# EAGLE design ETH_Design_ESP32 (EAGLE 9.6.1)
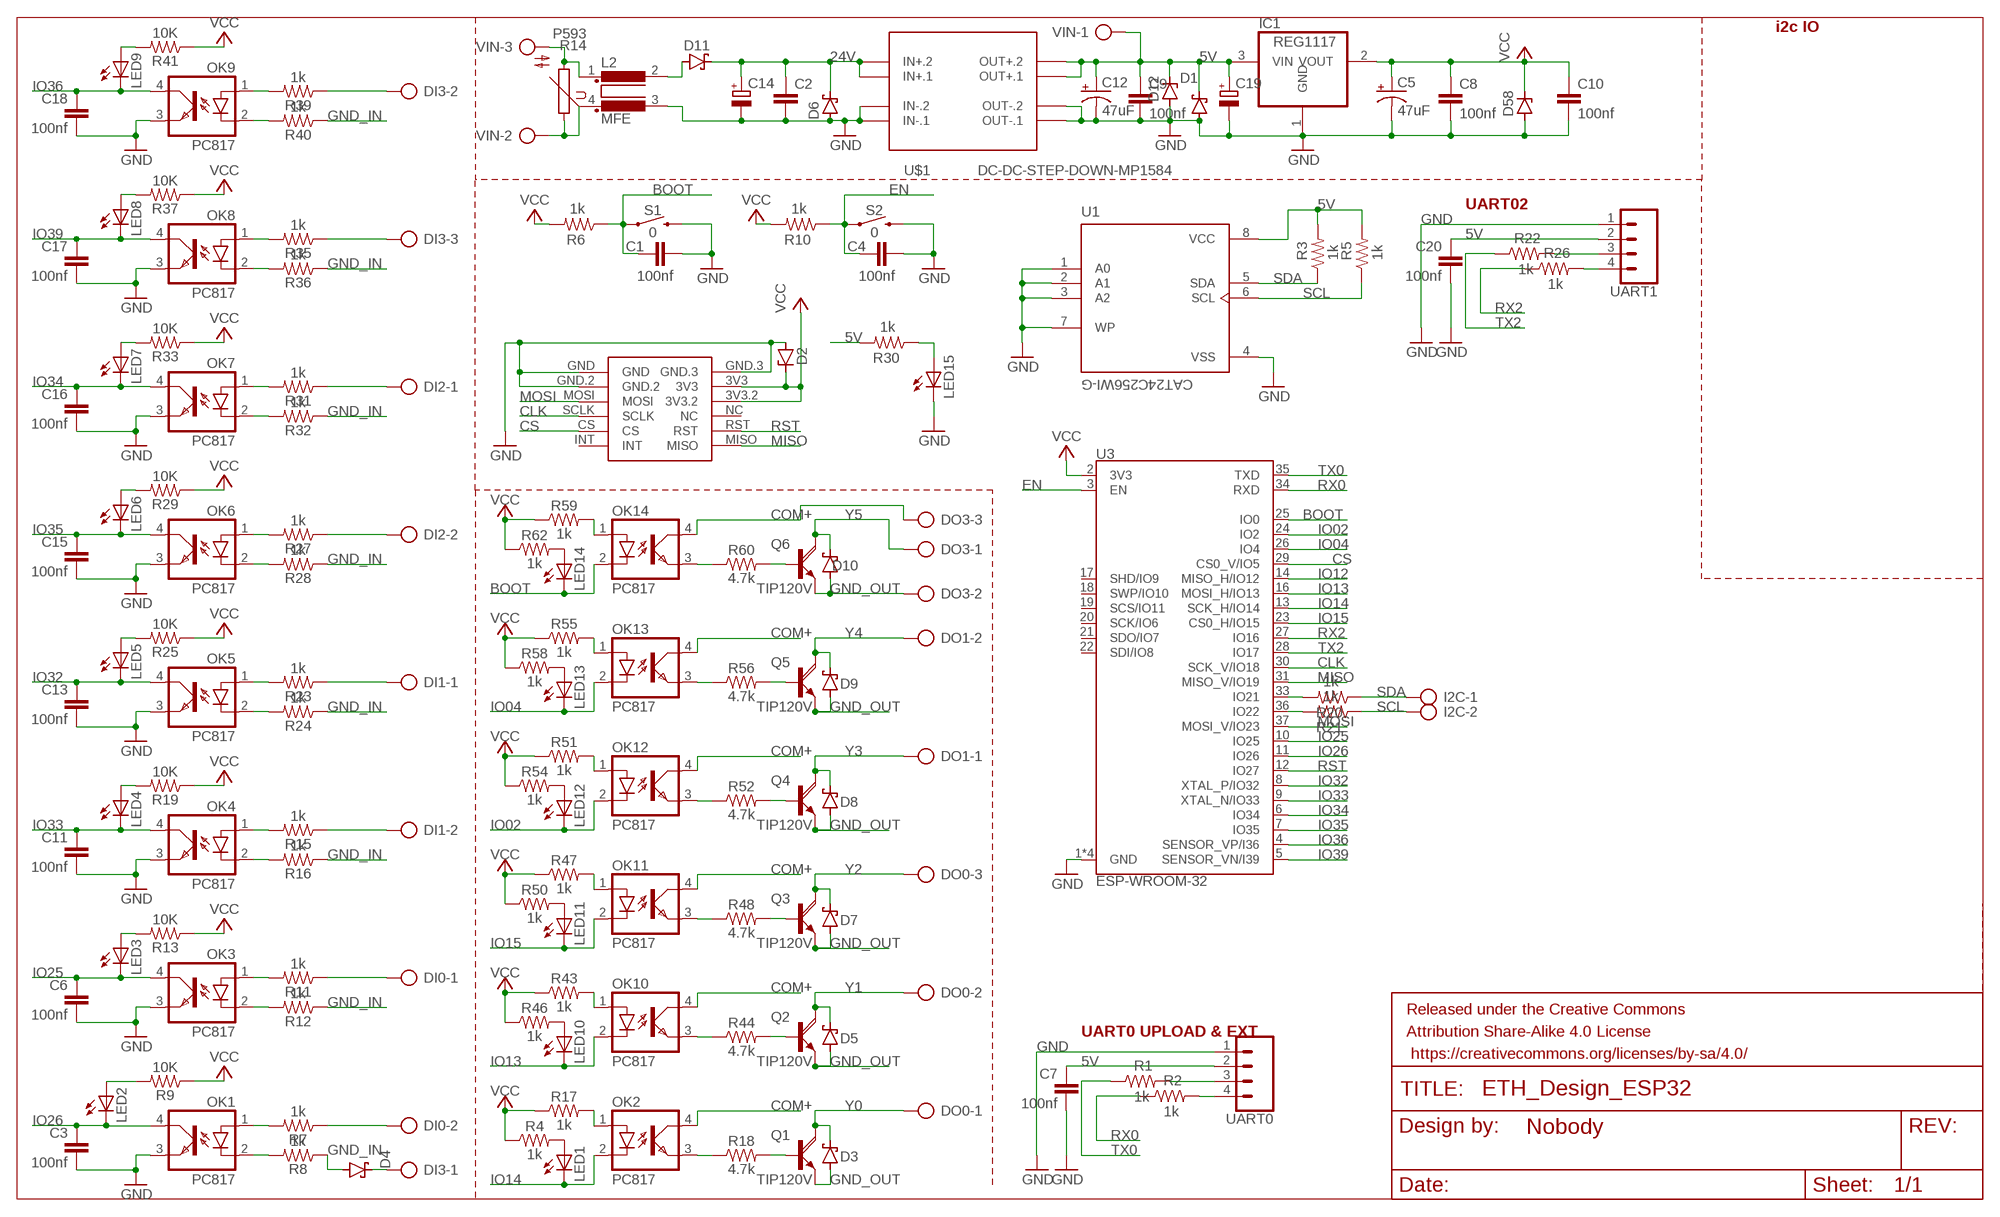
[diagram p0: schematic, sheet 1]

## Parts
C1  100nf  39NF-0805-50V-10%  [0805]
C2  C-EUC1206K  [C1206K]
C3  100nf  39NF-0805-50V-10%  [0805]
C4  100nf  39NF-0805-50V-10%  [0805]
C5  47uF  47UF-POLAR-EIA3528-10V-10%  [EIA3528]
C6  100nf  39NF-0805-50V-10%  [0805]
C7  100nf  39NF-0805-50V-10%  [0805]
C8  100nf  39NF-0805-50V-10%  [0805]
C9  100nf  39NF-0805-50V-10%  [0805]
C10  100nf  39NF-0805-50V-10%  [0805]
C11  100nf  39NF-0805-50V-10%  [0805]
C12  47uF  47UF-POLAR-EIA3528-10V-10%  [EIA3528]
C13  100nf  39NF-0805-50V-10%  [0805]
C14  CPOL-EUE2.5-7  [E2,5-7]
C15  100nf  39NF-0805-50V-10%  [0805]
C16  100nf  39NF-0805-50V-10%  [0805]
C17  100nf  39NF-0805-50V-10%  [0805]
C18  100nf  39NF-0805-50V-10%  [0805]
C19  CPOL-EUE2.5-7  [E2,5-7]
C20  100nf  39NF-0805-50V-10%  [0805]
D1  SCHOTTKY-DIODESMD  [SMB]
D2  ZENER-DIODESOD80C  [SOD80C]
D3  SCHOTTKY-DIODESMD  [SMB]
D4  SCHOTTKY-DIODESMD  [SMB]
D5  SCHOTTKY-DIODESMD  [SMB]
D6  SCHOTTKY-DIODESMD  [SMB]
D7  SCHOTTKY-DIODESMD  [SMB]
D8  SCHOTTKY-DIODESMD  [SMB]
D9  SCHOTTKY-DIODESMD  [SMB]
D10  SCHOTTKY-DIODESMD  [SMB]
D11  SCHOTTKY-DIODESMD  [SMB]
D12  ZENER-DIODESOD80C  [SOD80C]
D58  ZENER-DIODESOD80C  [SOD80C]
DI0  AK500/2  [AK500/2]
DI1  AK500/2  [AK500/2]
DI2  AK500/2  [AK500/2]
DI3  AK500/3  [AK500/3]
DO0  AK500/3  [AK500/3]
DO1  AK500/2  [AK500/2]
DO3  AK500/3  [AK500/3]
FRAME1  FRAME-LETTERNO_PACKAGE  [DUMMY]
I2C  AK500/2  [AK500/2]
IC1  REG1117  [SOT223]
L2  MFE  [MFE]
LED1  LEDCHIPLED_0805  [CHIPLED_0805]
LED2  LEDCHIPLED_0805  [CHIPLED_0805]
LED3  LEDCHIPLED_0805  [CHIPLED_0805]
LED4  LEDCHIPLED_0805  [CHIPLED_0805]
LED5  LEDCHIPLED_0805  [CHIPLED_0805]
LED6  LEDCHIPLED_0805  [CHIPLED_0805]
LED7  LEDCHIPLED_0805  [CHIPLED_0805]
LED8  LEDCHIPLED_0805  [CHIPLED_0805]
LED9  LEDCHIPLED_0805  [CHIPLED_0805]
LED10  LEDCHIPLED_0805  [CHIPLED_0805]
LED11  LEDCHIPLED_0805  [CHIPLED_0805]
LED12  LEDCHIPLED_0805  [CHIPLED_0805]
LED13  LEDCHIPLED_0805  [CHIPLED_0805]
LED14  LEDCHIPLED_0805  [CHIPLED_0805]
LED15  LEDCHIPLED_0805  [CHIPLED_0805]
OK1  PC817  [DIL04]
OK2  PC817  [DIL04]
OK3  PC817  [DIL04]
OK4  PC817  [DIL04]
OK5  PC817  [DIL04]
OK6  PC817  [DIL04]
OK7  PC817  [DIL04]
OK8  PC817  [DIL04]
OK9  PC817  [DIL04]
OK10  PC817  [DIL04]
OK11  PC817  [DIL04]
OK12  PC817  [DIL04]
OK13  PC817  [DIL04]
OK14  PC817  [DIL04]
Q1  TIP120V  [TO220AV]
Q2  TIP120V  [TO220AV]
Q3  TIP120V  [TO220AV]
Q4  TIP120V  [TO220AV]
Q5  TIP120V  [TO220AV]
Q6  TIP120V  [TO220AV]
R1  1k  0.3OHM-0805-1/8W-1%  [0805]
R2  1k  0.3OHM-0805-1/8W-1%  [0805]
R3  1k  0.3OHM-0805-1/8W-1%  [0805]
R4  1k  0.75OHM-0805-1/4W-1%  [0805]
R5  1k  0.3OHM-0805-1/8W-1%  [0805]
R6  1k  0.3OHM-0805-1/8W-1%  [0805]
R7  1k  0.75OHM-0805-1/4W-1%  [0805]
R8  1k  0.75OHM-0805-1/4W-1%  [0805]
R9  10K  0.75OHM-0805-1/4W-1%  [0805]
R10  1k  0.3OHM-0805-1/8W-1%  [0805]
R11  1k  0.75OHM-0805-1/4W-1%  [0805]
R12  1k  0.75OHM-0805-1/4W-1%  [0805]
R13  10K  0.75OHM-0805-1/4W-1%  [0805]
R14  P593  [P593]
R15  1k  0.75OHM-0805-1/4W-1%  [0805]
R16  1k  0.75OHM-0805-1/4W-1%  [0805]
R17  1k  0.75OHM-0805-1/4W-1%  [0805]
R18  4.7k  0.75OHM-0805-1/4W-1%  [0805]
R19  10K  0.75OHM-0805-1/4W-1%  [0805]
R20  1k  0.3OHM-0805-1/8W-1%  [0805]
R21  1k  0.3OHM-0805-1/8W-1%  [0805]
R22  1k  0.3OHM-0805-1/8W-1%  [0805]
R23  1k  0.75OHM-0805-1/4W-1%  [0805]
R24  1k  0.75OHM-0805-1/4W-1%  [0805]
R25  10K  0.75OHM-0805-1/4W-1%  [0805]
R26  1k  0.3OHM-0805-1/8W-1%  [0805]
R27  1k  0.75OHM-0805-1/4W-1%  [0805]
R28  1k  0.75OHM-0805-1/4W-1%  [0805]
R29  10K  0.75OHM-0805-1/4W-1%  [0805]
R30  1k  0.3OHM-0805-1/8W-1%  [0805]
R31  1k  0.75OHM-0805-1/4W-1%  [0805]
R32  1k  0.75OHM-0805-1/4W-1%  [0805]
R33  10K  0.75OHM-0805-1/4W-1%  [0805]
R35  1k  0.75OHM-0805-1/4W-1%  [0805]
R36  1k  0.75OHM-0805-1/4W-1%  [0805]
R37  10K  0.75OHM-0805-1/4W-1%  [0805]
R39  1k  0.75OHM-0805-1/4W-1%  [0805]
R40  1k  0.75OHM-0805-1/4W-1%  [0805]
R41  10K  0.75OHM-0805-1/4W-1%  [0805]
R43  1k  0.75OHM-0805-1/4W-1%  [0805]
R44  4.7k  0.75OHM-0805-1/4W-1%  [0805]
R46  1k  0.75OHM-0805-1/4W-1%  [0805]
R47  1k  0.75OHM-0805-1/4W-1%  [0805]
R48  4.7k  0.75OHM-0805-1/4W-1%  [0805]
R50  1k  0.75OHM-0805-1/4W-1%  [0805]
R51  1k  0.75OHM-0805-1/4W-1%  [0805]
R52  4.7k  0.75OHM-0805-1/4W-1%  [0805]
R54  1k  0.75OHM-0805-1/4W-1%  [0805]
R55  1k  0.75OHM-0805-1/4W-1%  [0805]
R56  4.7k  0.75OHM-0805-1/4W-1%  [0805]
R58  1k  0.75OHM-0805-1/4W-1%  [0805]
R59  1k  0.75OHM-0805-1/4W-1%  [0805]
R60  4.7k  0.75OHM-0805-1/4W-1%  [0805]
R62  1k  0.75OHM-0805-1/4W-1%  [0805]
S1  0  MOMENTARY-SWITCH-SPST-PTH-6.0MM-KIT  [TACTILE_SWITCH_PTH_6.0MM_KIT]
S2  0  MOMENTARY-SWITCH-SPST-PTH-6.0MM-KIT  [TACTILE_SWITCH_PTH_6.0MM_KIT]
U1  CAT24C256WI-G  [SOIC127P600X175-8N]
U3  ESP-WROOM-32  [ESP-WROOM-32]
U$1  DC-DC-STEP-DOWN-MP1584  [DC-DC-STEP-DOWN-MP1584]
U$2  MINI_W5500  [MINI_W5500]
UART0  CONN_04POLAR  [MOLEX-1X4]
UART1  CONN_04POLAR  [MOLEX-1X4]
VIN  AK500/3  [AK500/3]

## Nets
5V: C7.1 C9.1 C12.A(+) C19.+ C20.1 D1.C D12.C IC1.3(VIN) R3.2 R5.2 R30.2 U1.8(VCC) U$1.OUT+.1 U$1.OUT+.2 UART0.2 UART1.2 VIN.1
24V: C2.1 C14.+ D6.C D11.C U$1.IN+.1 U$1.IN+.2
BOOT: C1.2 LED14.C OK14.2(C) R6.1 S1.1 U3.25(IO0)
CLK: U3.30(SCK_V/IO18) U$2.SCLK
COM+: DO3.3 OK2.4(COL) OK10.4(COL) OK11.4(COL) OK12.4(COL) OK13.4(COL) OK14.4(COL)
CS: U3.29(CS0_V/IO5) U$2.CS
EN: C4.2 R10.1 S2.1 U3.3(EN)
GND: C1.1 C2.2 C3.2 C4.1 C5.C(-) C6.2 C7.2 C8.2 C9.2 C10.2 C11.2 C12.C(-) C13.2 C14.- C15.2 C16.2 C17.2 C18.2 C19.- C20.2 D1.A D2.A D6.A D12.A D58.A IC1.1(GND) L2.3 LED15.C OK1.3(EMIT) OK3.3(EMIT) OK4.3(EMIT) OK5.3(EMIT) OK6.3(EMIT) OK7.3(EMIT) OK8.3(EMIT) OK9.3(EMIT) S1.3 S2.3 U1.1(A0) U1.2(A1) U1.3(A2) U1.4(VSS) U1.7(WP) U3.1(GND) U3.15(GND) U3.38(GND) U3.GND U$1.IN-.1 U$1.IN-.2 U$1.OUT-.1 U$1.OUT-.2 U$2.GND U$2.GND.2 U$2.GND.3 UART0.1 UART1.1
GND_IN: D4.A R8.1 R12.1 R16.1 R24.1 R28.1 R32.1 R36.1 R40.1
GND_OUT: D3.A D5.A D7.A D8.A D9.A D10.A DO3.2 Q1.E Q2.E Q3.E Q4.E Q5.E Q6.E
IO02: LED12.C OK12.2(C) U3.24(IO2)
IO04: LED13.C OK13.2(C) U3.26(IO4)
IO12: U3.14(MISO_H/IO12)
IO13: LED10.C OK10.2(C) U3.16(MOSI_H/IO13)
IO14: LED1.C OK2.2(C) U3.13(SCK_H/IO14)
IO15: LED11.C OK11.2(C) U3.23(CS0_H/IO15)
IO25: C6.1 LED3.C OK3.4(COL) U3.10(IO25)
IO26: C3.1 LED2.C OK1.4(COL) U3.11(IO26)
IO32: C13.1 LED5.C OK5.4(COL) U3.8(XTAL_P/IO32)
IO33: C11.1 LED4.C OK4.4(COL) U3.9(XTAL_N/IO33)
IO34: C16.1 LED7.C OK7.4(COL) U3.6(IO34)
IO35: C15.1 LED6.C OK6.4(COL) U3.7(IO35)
IO36: C18.1 LED9.C OK9.4(COL) U3.4(SENSOR_VP/I36)
IO39: C17.1 LED8.C OK8.4(COL) U3.5(SENSOR_VN/I39)
MISO: U3.31(MISO_V/IO19) U$2.MISO
MOSI: U3.37(MOSI_V/IO23) U$2.MOSI
N$1: R1.2 UART0.3
N$2: R2.2 UART0.4
N$3: R22.2 UART1.3
N$4: OK1.1(A) R7.2
N$5: L2.1 R14.2 VIN.3
N$6: L2.4 R14.1 VIN.2
N$7: OK2.1(A) R17.2
N$8: LED1.A R4.2
N$9: LED8.A R37.2
N$10: OK1.2(C) R8.2
N$11: LED7.A R33.2
N$12: LED6.A R29.2
N$13: LED5.A R25.2
N$14: R26.2 UART1.4
N$15: LED15.A R30.1
N$16: OK3.1(A) R11.2
N$17: OK2.3(EMIT) R18.1
N$19: D11.A L2.2
N$20: OK3.2(C) R12.2
N$23: LED2.A R9.2
N$24: LED3.A R13.2
N$25: OK4.1(A) R15.2
N$26: OK4.2(C) R16.2
N$27: LED4.A R19.2
N$28: R20.2 U3.33(IO21)
N$29: R21.2 U3.36(IO22)
N$31: OK5.1(A) R23.2
N$32: OK5.2(C) R24.2
N$44: OK6.1(A) R27.2
N$45: OK6.2(C) R28.2
N$48: OK7.1(A) R31.2
N$49: OK7.2(C) R32.2
N$52: OK8.1(A) R35.2
N$53: OK8.2(C) R36.2
N$62: OK9.1(A) R39.2
N$63: OK9.2(C) R40.2
N$66: DI0.2 R7.1
N$67: Q1.B R18.2
N$68: OK10.3(EMIT) R44.1
N$70: OK10.1(A) R43.2
N$71: LED10.A R46.2
N$73: Q2.B R44.2
N$74: OK11.3(EMIT) R48.1
N$76: OK11.1(A) R47.2
N$77: LED11.A R50.2
N$79: Q3.B R48.2
N$80: OK12.3(EMIT) R52.1
N$82: OK12.1(A) R51.2
N$83: LED12.A R54.2
N$84: LED9.A R41.2
N$85: Q4.B R52.2
N$86: OK13.3(EMIT) R56.1
N$87: DI0.1 R11.1
N$88: OK13.1(A) R55.2
N$89: LED13.A R58.2
N$90: DI1.2 R15.1
N$91: Q5.B R56.2
N$92: OK14.3(EMIT) R60.1
N$93: DI1.1 R23.1
N$94: OK14.1(A) R59.2
N$95: LED14.A R62.2
N$96: DI2.2 R27.1
N$97: Q6.B R60.2
N$98: DI2.1 R31.1
N$99: DI3.3 R35.1
N$100: DI3.2 R39.1
N$101: D4.C DI3.1
RST: U3.12(IO27) U$2.RST
RX0: R2.1 U3.34(RXD)
RX2: R26.1 U3.27(IO16)
SCL: I2C.2 R5.1 R21.1 U1.6(SCL)
SDA: I2C.1 R3.1 R20.1 U1.5(SDA)
TX0: R1.1 U3.35(TXD)
TX2: R22.1 U3.28(IO17)
VCC: C5.A(+) C8.1 C10.1 D2.C D58.C IC1.2(VOUT) R4.1 R6.2 R9.1 R10.2 R13.1 R17.1 R19.1 R25.1 R29.1 R33.1 R37.1 R41.1 R43.1 R46.1 R47.1 R50.1 R51.1 R54.1 R55.1 R58.1 R59.1 R62.1 U3.2(3V3) U$2.3V3 U$2.3V3.2
Y0: D3.C DO0.1 Q1.C
Y1: D5.C DO0.2 Q2.C
Y2: D7.C DO0.3 Q3.C
Y3: D8.C DO1.1 Q4.C
Y4: D9.C DO1.2 Q5.C
Y5: D10.C DO3.1 Q6.C
Unconnected: U3.17(SHD/IO9) U3.18(SWP/IO10) U3.19(SCS/IO11) U3.20(SCK/IO6) U3.21(SDO/IO7) U3.22(SDI/IO8) U$2.INT U$2.NC

## Notes on the sheet
- i2c IO
- UART02
- UART0 UPLOAD & EXT

## Library data of the parts
C1 C3 C4 C6-C11 C13 C15-C18 C20 = SparkFun-Capacitors:39NF: 39nF ceramic capacitors A capacitor is a passive two-terminal electrical component used to store electrical energy temporarily in an electric field.; PROD_ID: CAP-15816; VALUE: 39nF
C2 = rcl:C-EU: CAPACITOR, European symbol; SPICEPREFIX: C
C5 C12 = SparkFun-Capacitors:47UF-POLAR: 47µF polarized capacitors A capacitor is a passive two-terminal electrical component used to store electrical energy temporarily in an electric field.; PROD_ID: CAP-08310
C14 C19 = rcl:CPOL-EU: POLARIZED CAPACITOR, European symbol; SPICEPREFIX: C
D1 D3-D11 = diode:SCHOTTKY-DIODE: Schottky Diode
D2 D12 D58 = diode:ZENER-DIODE: Z-Diode
DI0 DI1 DI2 DO1 I2C = con-ptr500:AK500/2: CONNECTOR; OC_FARNELL: unknown; OC_NEWARK: unknown
DI3 DO0 DO3 VIN = con-ptr500:AK500/3: CONNECTOR; OC_FARNELL: unknown; OC_NEWARK: unknown
FRAME1 = SparkFun-Aesthetics:FRAME-LETTER: Schematic Frame - Letter Standard 8.5x11 US Letter frame; DESIGNER: Nobody; VERSION: v01
IC1 = burr-brown:REG1117: 800mA and 1A Low Dropout (LDO) Positive Regulator 1.8V, 2.5V, 2.85V, 3.3V, 5V, and Adj; MPN: REG1117; OC_FARNELL: 1097566; OC_NEWARK: 14P6981
L2 = inductors:MFE: FILTER
LED1-LED15 = adafruit:LED: LED OSRAM: - CHIPLED LG R971, LG N971, LY N971, LG Q971, LY Q971, LO R971, LY R971 LH N974, LH R974 LS Q976, LO Q976, LY Q976 LO Q996 - Hyper CHIPLED LW Q18S LB Q993, LB Q99A, LB R99A - SideLED LS A670, LO A670, LY A670, LG A670, LP A670 LB A673, LV A673, LT A673, LW A673 LH A674 LY A675 LS A676, LA A676, LO A676, LY A676, LW A676 LS A679, LY A679, LG A679 - Hyper Micro SIDELED® LS Y876, LA Y876, LO Y876, LY Y876 LT Y87S - SmartLED LW L88C, LW L88S LB L89C, LB L89S, LG L890 LS L89K, LO L89K, LY L89K LS L896, LA L896, LO L896, LY L896 - TOPLED LS T670, LO T670, LY T670, LG T670, LP T670 LSG T670, LSP T670, LSY T670, LOP T670, LYG T670 LG T671, LOG T671, LSG T671 LB T673, LV T673, LT T673, LW T673 LH T674 LS T676, LA T676, LO T676, LY T676, LB T676, LH T676, LSB T676, LW T676 LB T67C, LV T67C, LT T67C, LS T67K, LO T67K, LY T67K, LW E67C LS E67B, LA E67B, LO E67B, LY E67B, LB E67C, LV E67C, LT E67C LW T67C LS T679, LY T679, LG T679 LS T770, LO T770, LY T770, LG T770, LP T770 LB T773, LV T773, LT T773, LW T773 LH T774 LS E675, LA E675, LY E675, LS T675 LS T776, LA T776, LO T776, LY T776, LB T776 LHGB T686 LT T68C, LB T68C - Hyper Mini TOPLED® LB M676 - Mini TOPLED Santana® LG M470 LS M47K, LO M47K, LY M47K Source: http://www.osram.convergy.de/
OK1-OK14 = optocoupler:PC817: SHARP OPTO COUPLER; MPN: PC817X4J000F; OC_FARNELL: 9707727; OC_NEWARK: 97K7059
Q1-Q6 = rocketfarm:TIP120: NPN DARLINGTON TRANSISTOR
R1-R3 R5 R6 R10 R20-R22 R26 R30 = SparkFun-Resistors:0.3OHM: 0.3Ω resistor A resistor is a passive two-terminal electrical component that implements electrical resistance as a circuit element. Resistors act to reduce current flow, and, at the same time, act to lower voltage levels within circuits. - Wikipedia; PROD_ID: RES-11622; VALUE: 0.3
R4 R7-R9 R11-R13 R15-R19 R23-R25 R27-R29 R31-R33 R35-R37 R39-R41 R43 R44 R46-R48 R50-R52 R54-R56 R58-R60 R62 = SparkFun-Resistors:0.75OHM: 0.75Ω resistor A resistor is a passive two-terminal electrical component that implements electrical resistance as a circuit element. Resistors act to reduce current flow, and, at the same time, act to lower voltage levels within circuits. - Wikipedia; PROD_ID: RES-08474; VALUE: 0.75
R14 = varistor:P593: VARISTOR
S1 S2 = SparkFun-Switches:MOMENTARY-SWITCH-SPST: Momentary Switch (Pushbutton) - SPST Normally-open (NO) SPST momentary switches (buttons, pushbuttons). Variants PTH-12MM - 12mm square, through-hole Momentary Pushbutton Switch - 12mm Square (COM-09190) PTH-6.0MM, PTH-6.0MM-KIT - 6.0mm square, through-hole Mini Pushbutton Switch (COM-00097) KIT package intended for soldering kit's - only one side of pads' copper is exposed. PTH-RIGHT-ANGLE-KIT - Right-angle, through-hole Right Angle Tactile Button - Used on SparkFun BigTime Watch Kit SMD-12MM - 12mm square, surface-mount Tactile Button - SMD (12mm) (COM-12993) Used on SparkFun PicoBoard SMD-4.5MM - 4.5mm Square Trackball Switch Used on SparkFun Blackberry Trackballer Breakout SMD-4.6MMX2.8MM - 4.60mm x 2.80mm, surface mount Used on SparkFun SAMD21 Mini Breakout SMD-5.2MM, SMD-5.2-REDUNDANT - 5.2mm square, surface-mount Mini Pushbutton Switch - SMD (COM-08720) Used on Arduino Pro Mini REDUNDANT package connects both switch circuits together SMD-6.0X3.5MM - 6.0 x 3.5mm, surface mount Momentary Reset Switch SMD (COM-08229) SMD-6.2MM-TALL - 6.2mm square, surface mount Tactile Button - SMD (6mm) Used on SparkFun Digital Sandbox SMD-RIGHT-ANGLE - Right-angle, surface mount Used on SparkFun Block for Intel® Edison - Arduino; PROD_ID: SWCH-08441; SF_SKU: COM-00097
U1 = CAT24C256WI-G:CAT24C256WI-G: EEPROM Memory IC 256Kb (32K x 8) I²C 1MHz 500ns 8-SOIC Check availability; AVAILABILITY: In Stock; DESCRIPTION: EEPROM, 256K, 256KX8, I2C, SOIC8; Memory Size:256Kbit; Memory Configuration:32K x 8; Interface Type:I2C; Clock Frequency:100kHz; Supply Voltage Range:1.8V to 5.5V; Memory Case Style:SOIC; No. of Pins:8; Operating Temperature Range:-40°C to +85°C; SVHC:No SVHC (18-Jun-2012); Frequency:400kHz; IC Generic Number:24C256; Interface:I2C; Interface Type:Serial, I2C; Memory Type:Serial EEPROM; Memory Voltage Vcc:1.8 to 5.5V; Operating Temperature Max:+85°C; Operating Temperature Min:-40°C; Package / Case:SOIC; Supply Voltage Max:5.5V; Supply Voltage Min:1.8V; Termination Type:SMD; MF: ON Semiconductor; MP: CAT24C256WI-G; PACKAGE: SOIC-8 ON; PRICE: None; PURCHASE-URL: https://pricing.snapeda.com/search/part/CAT24C256WI-G/?ref=eda
U3 = SparkFun-RF:ESP-WROOM-32; PROD_ID: IC-13849
U$1 = diy-modules:DC-DC-STEP-DOWN-MP1584: DC/DC Step-Down Regulator based on MP1584 chip MP1584 datasheet available here: http://www.haoyuelectronics.com/Attachment/MP1584/MP1584.pdf Click here to find device on ebay.com
U$2 = ethernet-w5500:MINI_W5500: MINI ETHERNET W5500, CREATE BY MIKROAVR.COM
UART0 UART1 = SparkFun-Connectors:CONN_04: Multi connection point. Often used as Generic Header-pin footprint for 0.1 inch spaced/style header connections On any of the 0.1 inch spaced packages, you can populate with these: Break Away Headers - Straight (PRT-00116) Break Away Male Headers - Right Angle (PRT-00553) Female Headers (PRT-00115) Break Away Headers - Machine Pin (PRT-00117) Break Away Female Headers - Swiss Machine Pin (PRT-00743) For SCREWTERMINALS and SPRING TERMINALS visit here: Screw Terimnals on SparkFun.com (5mm/3.5mm/2.54mm spacing) This device is also useful as a general connection point to wire up your design to another part of your project. Our various solder wires solder well into these plated through hole pads. Hook-Up Wire - Assortment (Stranded, 22 AWG) (PRT-11375) Hook-Up Wire - Assortment (Solid Core, 22 AWG) (PRT-11367) View the entire wire category on our website here Special notes: Molex polarized connector foot print use with SKU : PRT-08231 with associated crimp pins and housings. 1MM SMD Version SKU: PRT-10208; PROD_ID: CONN-08186; SF_ID: PRT-08231

## Board
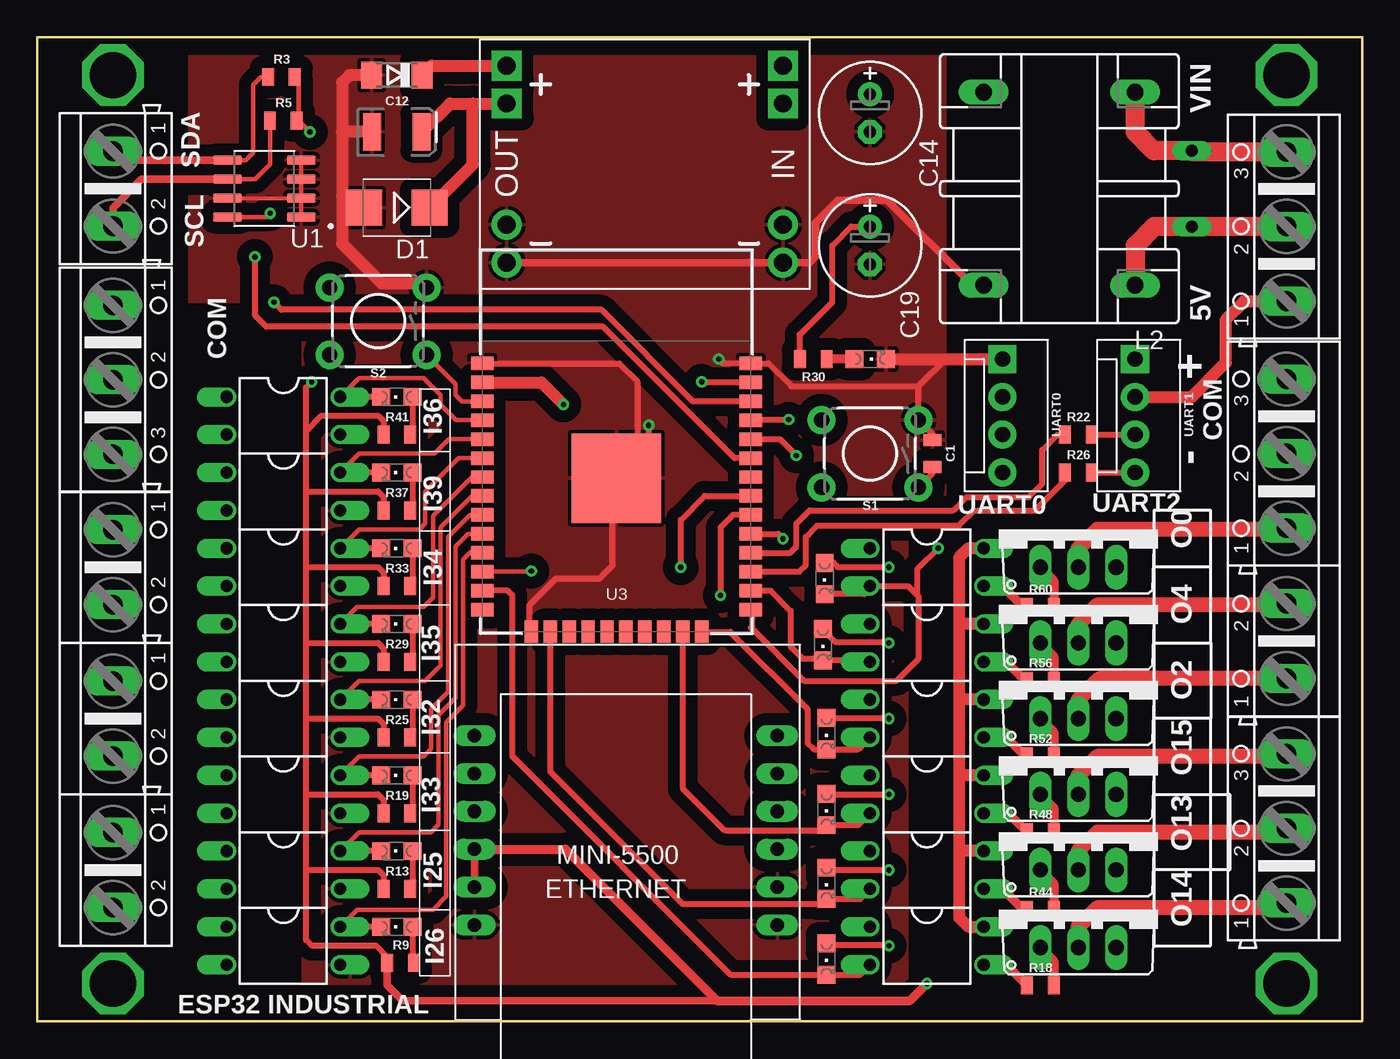
[diagram p1: board, top side]
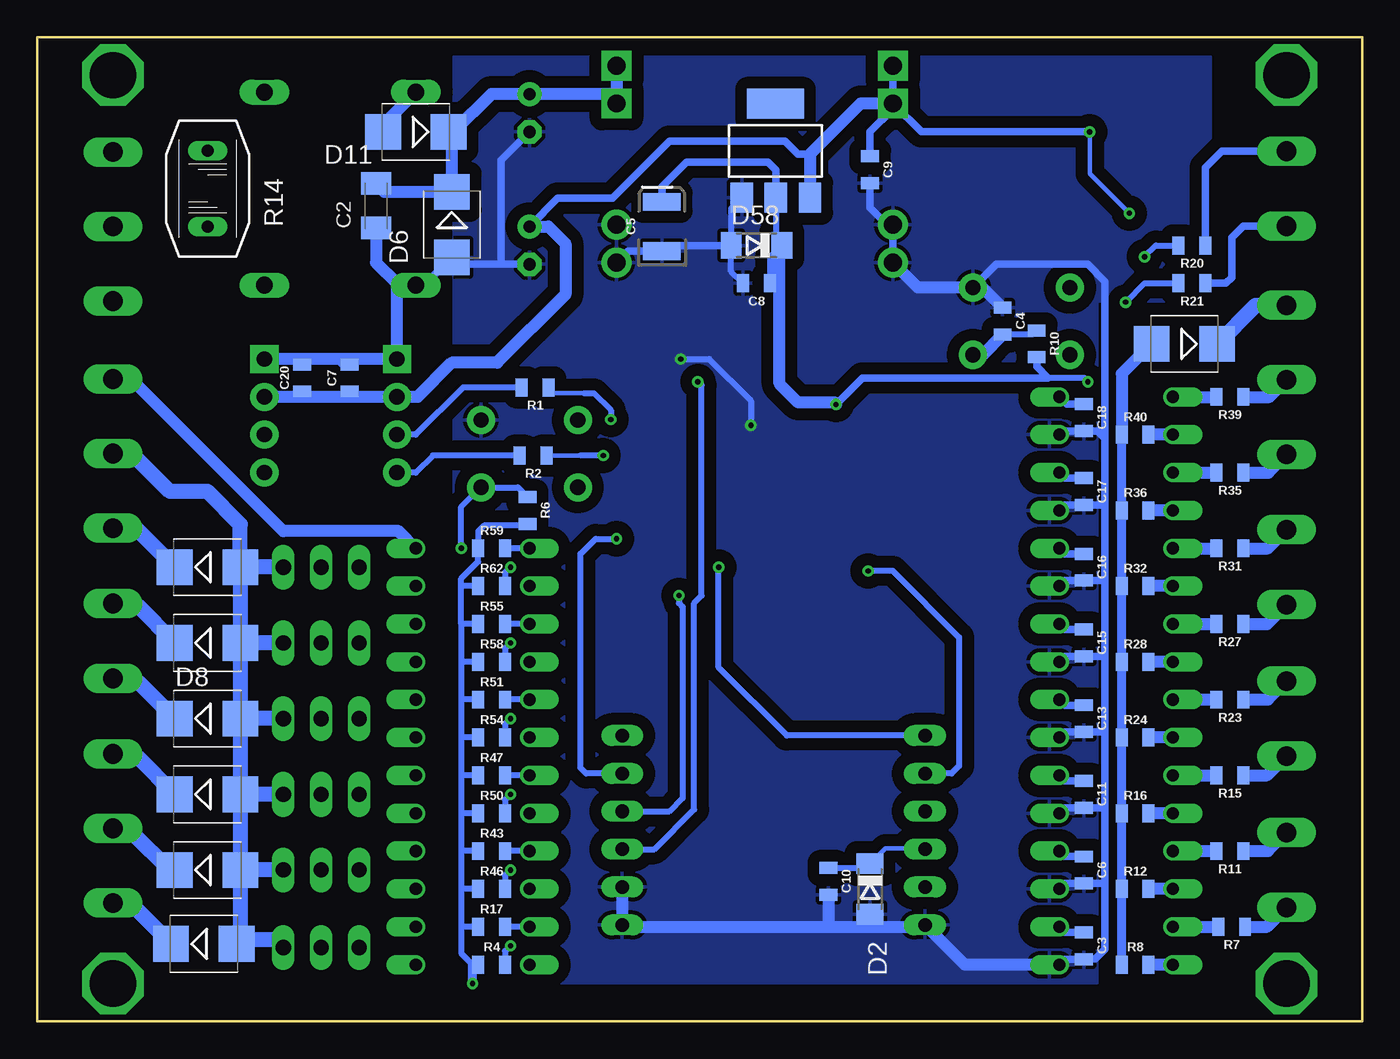
[diagram p2: board, bottom side, seen from below]

Size 88.9 x 66.04 mm. Coordinates in mm from the lower left corner, seen from the top.
Outline: 0,0 88.9,0 88.9,66.04 0,66.04 0,0
Copper layers (1*16): Top 0.035mm / dielectric 1.5mm / Bottom 0.035mm
Design rules "default": minimum track width 6mil, minimum drill 0.35mm, track to track 6mil, track to pad 6mil, pad to pad 6mil, via to via 6mil, smd to smd 6mil, copper to edge 40mil, drill to drill 6mil, minimum pad ring 10mil, minimum via ring 8mil, stop-mask expansion 4mil, vias tented up to drill 0mil, thermal gap 10mil

### Footprints (pad centres in the part's own frame; a part is rotated, then mirrored left to right if it is on the bottom)
0805 = smd 0.8 x 1.2: 1 -0.9,0; 2 0.9,0
C1206K = smd 1.5 x 2: 1 -1.5,0; 2 1.5,0
EIA3528 = smd 1.2 x 2.5: A 1.65,0; C -1.65,0
E2,5-7 = drill 0.813 pad 1.6: + -1.27,0 | drill 0.813 pad 1.6 octagon: - 1.27,0
SMB = smd 2.4 x 2.4: A 2.2,0; C -2.2,0
SOD80C = smd 1.4 x 1.8: A 1.7,0; C -1.7,0
AK500/2 = drill 1.321 long: 1 -2.515,0; 2 2.515,0
AK500/3 = drill 1.321 long: 1 -5.004,0; 2 0,0; 3 5.004,0
SOT223 = smd 1.499 x 2.007: 1 -2.261,-3.15; 2 0.025,-3.15; 3 2.311,-3.15 | smd 3.81 x 2.007: 4 0,3.15
MFE = drill 1.118 long: 1 6.477,-5.08; 2 6.477,5.08; 3 -6.477,5.08; 4 -6.477,-5.08
CHIPLED_0805 = smd 1.2 x 1.2: A 0,-1.05; C 0,1.05
DIL04 = drill 0.813 offset: 1 -1.27,-3.81; 2 1.27,-3.81; 3 1.27,3.81; 4 -1.27,3.81
TO220AV = drill 1.016 long: B -2.54,-2.54; C 0,-2.54; E 2.54,-2.54
P593 = drill 0.813 long: 1 0,2.54; 2 0,-2.54
TACTILE_SWITCH_PTH_6.0MM_KIT = drill 1.016 pad 1.88: 1 -3.251,2.261; 2 3.251,2.261; 3 -3.251,-2.261; 4 3.251,-2.261
SOIC127P600X175-8N = smd 1.97 x 0.6: 1 -2.475,1.905; 2 -2.475,0.635; 3 -2.475,-0.635; 4 -2.475,-1.905; 5 2.475,-1.905; 6 2.475,-0.635; 7 2.475,0.635; 8 2.475,1.905
ESP-WROOM-32 = smd 0.9 x 1.5: 1 7.7,9; 2 6.43,9; 3 5.16,9; 4 3.89,9; 5 2.62,9; 6 1.35,9; 7 0.08,9; 8 -1.19,9; 9 -2.46,9; 10 -3.73,9; 11 -5,9; 12 -6.27,9; 13 -7.54,9; 14 -8.81,9; 25 -8.81,-9; 26 -7.54,-9; 27 -6.27,-9; 28 -5,-9; 29 -3.73,-9; 30 -2.46,-9; 31 -1.19,-9; 32 0.08,-9; 33 1.35,-9; 34 2.62,-9; 35 3.89,-9; 36 5.16,-9; 37 6.43,-9; 38 7.7,-9 | smd 1.5 x 0.9: 15 -10.3,5.715; 16 -10.3,4.445; 17 -10.3,3.175; 18 -10.3,1.905; 19 -10.3,0.635; 20 -10.3,-0.635; 21 -10.3,-1.905; 22 -10.3,-3.175; 23 -10.3,-4.445; 24 -10.3,-5.715 | smd 6 x 6: GND 0,0
DC-DC-STEP-DOWN-MP1584 = drill 1.2 pad 2 square: IN+.1 -9.271,-4.064; IN+.2 -9.271,-6.604; OUT+.1 9.271,-4.064; OUT+.2 9.271,-6.604 | drill 1.2 pad 2: IN-.1 -9.271,6.604; IN-.2 -9.271,4.064; OUT-.1 9.271,6.604; OUT-.2 9.271,4.064
MINI_W5500 = drill 0.914 long: 3V3 21.844,-8.89; 3V3.2 21.844,-11.43; CS 1.524,-16.51; GND 1.524,-6.35; GND.2 1.524,-8.89; GND.3 21.844,-6.35; INT 1.524,-19.05; MISO 21.844,-19.05; MOSI 1.524,-11.43; NC 21.844,-13.97; RST 21.844,-16.51; SCLK 1.524,-13.97
MOLEX-1X4 = drill 1.016 pad 1.88 square: 1 0,0 | drill 1.016 pad 1.88: 2 2.54,0; 3 5.08,0; 4 7.62,0

### Placement (x,y rotation side)
C1  60.07,38.1 270 top
C2  66.17,54.74 270 bottom
C3  18.67,5.08 270 bottom
C4  24.13,46.99 270 bottom
C5  46.99,53.34 90 bottom
C6  18.67,10.16 270 bottom
C7  67.95,43.18 90 bottom
C8  40.64,49.53 180 bottom
C9  33.02,57.15 270 bottom
C10  35.81,9.4 270 bottom
C11  18.67,15.24 270 bottom
C12  24.13,59.69 0 top
C13  18.67,20.32 270 bottom
C14  55.88,60.96 270 top
C15  18.67,25.4 270 bottom
C16  18.67,30.48 270 bottom
C17  18.67,35.56 270 bottom
C18  18.67,40.51 270 bottom
C19  55.88,52.07 270 top
C20  71.12,43.18 90 bottom
D1  24.13,54.61 180 top
D2  33.02,8.89 270 bottom
D3  77.72,5.21 0 bottom
D4  11.94,45.47 180 bottom
D5  77.47,10.16 0 bottom
D6  61.09,53.47 270 bottom
D7  77.47,15.24 0 bottom
D8  77.47,20.32 0 bottom
D9  77.47,25.4 0 bottom
D10  77.47,30.48 0 bottom
D11  63.5,59.69 180 bottom
D12  24.13,63.5 180 top
D58  40.64,52.07 180 bottom
DI0  5.08,10.16 270 top
DI1  5.08,20.32 270 top
DI2  5.08,30.48 270 top
DI3  5.08,43.05 270 top
DO0  83.82,12.95 90 top
DO1  83.82,25.53 90 top
DO3  83.82,38.1 90 top
FRAME1  0,0 0 top
I2C  5.08,55.88 270 top
IC1  39.37,58.42 0 bottom
L2  68.58,55.88 90 top
LED1  52.96,4.19 180 top
LED2  24.13,6.35 90 top
LED3  24.13,11.43 90 top
LED4  24.13,16.51 90 top
LED5  24.13,21.59 90 top
LED6  24.13,26.67 90 top
LED7  24.13,31.75 90 top
LED8  24.13,36.83 90 top
LED9  24.13,41.91 90 top
LED10  52.96,9.27 180 top
LED11  52.96,14.22 180 top
LED12  52.96,19.3 180 top
LED13  52.7,25.27 180 top
LED14  52.83,29.72 180 top
LED15  55.88,44.45 270 top
OK1  16.51,5.08 270 top
OK2  59.69,5.08 270 top
OK3  16.51,10.16 270 top
OK4  16.51,15.24 270 top
OK5  16.51,20.32 270 top
OK6  16.51,25.4 270 top
OK7  16.51,30.48 270 top
OK8  16.51,35.56 270 top
OK9  16.51,40.64 270 top
OK10  59.69,10.16 270 top
OK11  59.69,15.24 270 top
OK12  59.69,20.32 270 top
OK13  59.69,25.4 270 top
OK14  59.69,30.48 270 top
Q1  69.85,7.49 0 top
Q2  69.85,12.7 0 top
Q3  69.85,17.78 0 top
Q4  69.85,22.86 0 top
Q5  69.85,27.94 0 top
Q6  69.85,33.02 0 top
R1  55.5,42.55 180 bottom
R2  55.63,37.97 180 bottom
R3  16.38,63.37 0 top
R4  58.42,3.81 0 bottom
R5  16.51,60.45 0 top
R6  56.01,34.29 270 bottom
R7  8.76,6.35 180 bottom
R8  15.24,3.81 0 bottom
R9  24.38,3.94 0 top
R10  21.84,45.47 270 bottom
R11  8.89,11.43 180 bottom
R12  15.24,8.89 0 bottom
R13  24.13,8.89 0 top
R14  77.47,55.88 180 bottom
R15  8.89,16.51 180 bottom
R16  15.24,13.97 0 bottom
R17  58.42,6.35 0 bottom
R18  67.31,2.41 0 top
R19  24.13,13.97 0 top
R20  11.43,52.07 180 bottom
R21  11.43,49.53 180 bottom
R22  69.85,39.37 0 top
R23  8.89,21.59 180 bottom
R24  15.24,19.05 0 bottom
R25  24.13,19.05 0 top
R26  69.85,36.83 0 top
R27  8.89,26.67 180 bottom
R28  15.24,24.13 0 bottom
R29  24.13,24.13 0 top
R30  52.07,44.45 180 top
R31  8.89,31.75 180 bottom
R32  15.24,29.21 0 bottom
R33  24.13,29.21 0 top
R35  8.89,36.83 180 bottom
R36  15.24,34.29 0 bottom
R37  24.13,34.29 0 top
R39  8.89,41.91 180 bottom
R40  15.24,39.37 0 bottom
R41  24.13,39.37 0 top
R43  58.42,11.43 0 bottom
R44  67.31,7.49 0 top
R46  58.42,8.89 0 bottom
R47  58.42,16.51 0 bottom
R48  67.31,12.7 0 top
R50  58.42,13.97 0 bottom
R51  58.42,21.59 0 bottom
R52  67.31,17.78 0 top
R54  58.42,19.05 0 bottom
R55  58.42,26.67 0 bottom
R56  67.31,22.86 0 top
R58  58.42,24.13 0 bottom
R59  58.42,31.75 0 bottom
R60  67.31,27.81 0 top
R62  58.42,29.21 0 bottom
S1  55.88,38.1 180 top
S2  22.86,46.99 180 top
U1  15.24,55.88 180 top
U3  38.86,36.45 90 top
U$1  40.77,57.53 180 top
U$2  51.18,0.13 180 top
UART0  64.77,44.45 270 top
UART1  73.66,44.45 270 top
VIN  83.82,53.34 90 top

### Tracks (layer width: path | path; a pad name or v marks a point on that pad's centre or on a via)
5V  (via drill 0.35)
  Top 0.305: U1.8 15.37,53.97 v15.62,54.23 | v18.29,59.69 17.53,60.45 | 17.53,60.45 R5.2 | R3.2 17.53,63.13 17.53,60.45
  Top 0.406: R30.2 51.17,46.09 53.34,48.26 53.34,52.07 54.61,53.34 C19.+
  Top 0.813: D12.C 26.47,64.13 U$1.OUT+.2 | C12.A 27.69,61.59 29.21,61.59 | 29.21,61.59 U$1.OUT+.1 | D1.C 29.21,57.49 29.21,61.59 | UART1.2 77.47,41.91 79.76,44.2 79.76,47.12 80.98,48.34 VIN.1
  Bottom 0.305: v15.62,54.23 18.29,56.9 v18.29,59.69
  Bottom 0.508: v18.29,59.69 29.59,59.69 U$1.OUT+.1 | C9.1 33.02,59.69 31.5,61.21 U$1.OUT+.1 | U$1.OUT+.2 U$1.OUT+.1 | 37.06,58.19 37.87,58.19 38.73,59.06 46.48,59.06 50.29,55.25 53.98,55.25 C19.+
  Bottom 0.813: U$1.OUT+.1 33.66,61.59 37.06,58.19 IC1.3 | C19.+ 54.61,53.34 53.47,52.2 53.47,48.77 58.04,44.2 61.08,44.2 63.37,41.91 UART0.2 67.58,41.91 | 67.58,41.91 71.12,41.91 | 71.12,41.91 UART1.2 | C20.1 71.12,41.91 | C7.1 67.58,41.91
24V
  Bottom 0.813: U$1.IN+.2 50.04,62.23 | 50.04,62.23 U$1.IN+.1 | 50.04,62.23 C14.+ 58.42,62.23 60.96,59.69 D11.C 61.09,59.48 D6.C 65.6,55.67 C2.1
BOOT  (via drill 0.35)
  Top 0.406: LED14.C 55.5,28.67 55.88,29.05 OK14.2 58.42,29.21 59.06,28.58 | C1.2 60.07,36.78 S1.1 | 47.86,26.43 47.94,26.35 | 47.94,26.35 51.44,22.86 57.66,22.86 59.13,24.33 59.13,28.5 59.06,28.58 | 59.06,28.58 59.06,30.35 v60.45,31.75 | U3.25 47.94,27.56 47.94,26.35
  Bottom 0.406: R6.1 56.66,35.84 S1.1 60.45,34.52 v60.45,31.75
CLK  (via drill 0.35)
  Top 0.406: v45.85,28.58 45.85,33.15 46.69,33.99 U3.30
  Bottom 0.406: U$2.SCLK 46.48,14.1 45.59,14.99 45.59,27.81 45.85,28.07 v45.85,28.58
COM+
  Top 0.813: OK14.4 62.48,31.75 61.85,31.12 61.85,26.67 | 61.85,26.67 61.85,21.59 | 61.85,21.59 61.85,16.51 | 61.85,16.51 61.85,11.43 | 61.85,11.43 61.85,6.99 62.48,6.35 OK2.4 | OK13.4 61.85,26.67 | OK12.4 61.85,21.59 | OK11.4 61.85,16.51 | OK10.4 61.85,11.43
  Bottom 0.813: OK14.4 64.64,32.89 72.39,32.89 82.6,43.1 DO3.3
CS  (via drill 0.35)
  Top 0.406: U3.29 49.7,32.72 v50.04,32.38
  Bottom 0.406: U$2.CS 52.07,16.64 52.45,17.02 52.45,31.37 51.44,32.38 v50.04,32.38
EN
  Top 0.305: S2.1 28.07,42.77 28.07,42.04 28.5,41.61 U3.3
  Bottom 0.406: R10.1 22.12,46.09 C4.2
  Bottom 0.813: C4.2 25.49,44.73 S2.1
GND  (via drill 0.35)
  Top 0.254: U1.7 U1.2
  Top 0.305: U1.4 U1.3 U1.2 U1.1
  Top 0.406: C1.1 60.07,39.42 S1.3 59.13,42.62 | 59.13,42.62 60.96,44.45 UART0.1 | 59.13,42.62 50.6,42.62 49.07,44.15 U3.38 46.02,44.15 v45.72,44.45 | U3.15 33.02,26.28 33.02,27.94 34.8,29.72 37.72,29.72 38.61,30.61 38.61,36.19 | 38.61,36.19 38.61,36.96 38.86,36.7 U3.GND 40.26,37.85 40.26,42.93 39.04,44.15 U3.1 | v41.02,40 41.02,38.61 38.61,36.19
  Top 0.508: U$1.OUT-.1 U$1.IN-.1 51.82,50.93 52.2,51.31 52.2,53.59 53.72,55.12 57.02,55.12 62.74,49.4 L2.3
  Top 0.813: LED15.C UART0.1 | D12.A 20.96,63.5 20.45,62.99 20.45,59.69 | 20.45,55.37 21.72,54.1 21.93,54.31 D1.A | 20.45,59.69 20.45,55.37 | C12.C 20.45,59.69 | 20.45,55.37 20.45,52.2 23.11,49.53 25.83,49.53 S2.3
  Bottom 0.305: D2.A 33.02,6.68 32.64,6.3 29.51,6.3 U$2.GND.3 29.21,6.35
  Bottom 0.406: IC1.1 42.34,54.56 D58.A 42.34,50.33 C8.2 | v45.72,44.45 43.82,44.45 41.02,41.66 v41.02,40
  Bottom 0.508: OK9.3 20.08,39.61 C18.2 18.66,39.62 17.78,39.62 17.27,39.12 | OK8.3 19.95,34.66 C17.2 17.28,34.66 17.27,34.67 | OK7.3 19.95,29.58 C16.2 17.28,29.58 17.27,29.59 | OK6.3 19.95,24.5 C15.2 17.39,24.5 17.27,24.38 | OK5.3 19.95,19.42 C13.2 17.28,19.42 17.27,19.43 | OK4.3 19.95,14.34 C11.2 17.41,14.34 17.27,14.48 | OK3.3 19.95,9.26 C6.2 17.28,9.26 17.27,9.27 | OK1.3 19.95,4.18 C3.2 18.66,4.19 17.91,4.19 17.27,4.83 17.27,9.27 | 17.27,9.27 17.27,14.48 | 17.27,14.48 17.27,19.43 | 17.27,19.43 17.27,24.38 | 17.27,24.38 17.27,29.59 | 17.27,29.59 17.27,34.67 | 17.27,34.67 17.27,39.12 | C9.2 33.02,54.61 31.88,53.47 U$1.OUT-.2 U$1.OUT-.1 | 17.27,39.12 17.27,49.66 18.42,50.8 24.56,50.8 S2.3 | D58.A 46.61,52.07 C5.C 49.28,51.69 U$1.IN-.1 | L2.3 62.95,49.4 D6.A 60.62,50.8 57.79,50.8 | C19.- 57.79,50.8 | C14.- 57.79,57.78 57.79,50.8
  Bottom 0.813: U$1.OUT-.1 29.82,49.25 S2.3 25.49,49.25 C4.1 | OK1.3 26.67,3.81 29.21,6.35 35.56,6.35 | 35.56,6.35 49.53,6.35 U$2.GND U$2.GND.2 | C10.2 35.81,6.6 35.56,6.35 | C2.2 66.17,50.93 64.77,49.53 | L2.3 64.64,49.4 64.77,49.53 | 64.77,49.53 UART0.1 68.58,44.45 | 68.58,44.45 71.49,44.45 | 71.49,44.45 UART1.1 | C7.2 68.21,44.08 68.58,44.45 | C20.2 71.49,44.45
  pour Top (isolate 0.8): 10.16,64.77 10.16,48.26 17.78,48.26 17.78,2.54 58.42,2.54 58.42,34.29 60.96,34.29 60.96,64.77
  pour Bottom (isolate 0.8): 10.16,64.77 10.16,48.26 17.78,48.26 17.78,2.54 58.42,2.54 58.42,34.29 60.96,34.29 60.96,64.77
GND_IN
  Bottom 0.61: R8.1 R12.1 R16.1 R24.1 R28.1 R32.1 R36.1 R40.1
  Bottom 0.813: D4.A 16.14,43.46 R40.1
GND_OUT
  Bottom 1.016: Q6.E D10.A | D10.A D9.A | D9.A D8.A | D8.A D7.A | D7.A D5.A | D5.A 75.27,5.46 | 75.27,5.46 D3.A | Q5.E D9.A | Q4.E D8.A | Q3.E D7.A | Q2.E D5.A | Q1.E 72.9,5.46 75.27,5.46 | D10.A 75.27,33.36 77.47,35.56 80.01,35.56 82.55,38.1 DO3.2
IO02
  Top 0.406: OK12.2 55.08,18.25 LED12.C 52.1,18.25 51.69,18.67 51.69,20.96 46.5,26.15 U3.24
IO04
  Top 0.406: OK13.2 55.79,24.22 LED13.C 52.58,24.35 51.34,24.35 50.55,25.15 50.55,27.56 49.2,28.91 U3.26
IO13
  Top 0.406: OK10.2 55.21,8.22 LED10.C 52.61,7.87 43.31,7.87 34.42,16.76 U3.16
IO14
  Top 0.406: OK2.2 55.21,3.14 LED1.C 46.52,3.14 31.88,17.78 31.88,28.58 31.54,28.91 U3.13
IO15
  Top 0.406: OK11.2 55.08,13.17 LED11.C 52.61,12.83 46.1,12.83 43.31,15.62 U3.23
IO25
  Top 0.305: OK3.4 21.59,12.7 26.42,12.7 26.92,13.21 26.92,20.57 28.07,21.72 28.07,31.88 28.91,32.72 U3.10
  Top 0.406: LED3.C OK3.4
  Bottom 0.508: C6.1 19.95,11.06 OK3.4
IO26
  Top 0.305: OK1.4 21.46,7.49 26.54,7.49 27.43,8.38 27.43,20.07 28.58,21.21 28.58,30.99 29.08,31.5 29.82,31.5 U3.11
  Top 0.406: LED2.C OK1.4
  Bottom 0.508: C3.1 19.95,5.98 OK1.4
IO32
  Top 0.305: OK5.4 21.59,22.86 26.04,22.86 27.05,23.88 27.05,33.15 29.16,35.26 U3.8
  Top 0.406: LED5.C OK5.4
  Bottom 0.508: C13.1 19.95,21.22 OK5.4
IO33
  Top 0.305: OK4.4 21.59,17.78 25.91,17.78 26.42,18.29 26.42,20.96 27.56,22.1 27.56,32.51 29.04,33.99 U3.9
  Top 0.406: LED4.C OK4.4
  Bottom 0.508: C11.1 19.95,16.14 OK4.4
IO34
  Top 0.305: OK7.4 21.59,33.02 25.65,33.02 26.04,33.4 26.04,35.56 28.27,37.8 U3.6
  Top 0.406: LED7.C OK7.4
  Bottom 0.508: C16.1 19.95,31.38 OK7.4
IO35
  Top 0.305: OK6.4 21.46,27.81 25.91,27.81 26.54,28.45 26.54,33.91 29.16,36.53 U3.7
  Top 0.406: LED6.C OK6.4
  Bottom 0.508: C15.1 19.95,26.3 OK6.4
IO36
  Top 0.305: OK9.4 21.59,43.18 25.91,43.18 27.05,42.04 27.05,41.4 28.11,40.34 U3.4
  Top 0.406: LED9.C OK9.4
  Bottom 0.508: OK9.4 19.82,41.41 C18.1
IO39
  Top 0.305: OK8.4 21.59,38.1 26.67,38.1 27.64,39.07 U3.5
  Top 0.406: LED8.C OK8.4
  Bottom 0.508: C17.1 19.95,36.46 OK8.4
MISO  (via drill 0.35)
  Top 0.406: v43.18,30.48 43.18,33.66 44.78,35.26 U3.31
  Bottom 0.406: v43.18,30.48 43.18,23.75 38.61,19.18 U$2.MISO
MOSI  (via drill 0.35)
  Top 0.406: U3.37 44.62,42.88 v44.58,42.93
  Bottom 0.406: U$2.MOSI 47.5,11.56 44.83,14.22 44.83,28.07 44.32,28.58 44.32,42.67 v44.58,42.93
N$1
  Bottom 0.406: R1.2 60.33,42.55 63.5,39.37 UART0.3
N$2
  Bottom 0.406: R2.2 62.36,37.97 63.5,36.83 UART0.4
N$3
  Top 0.406: R22.2 UART1.3
N$4
  Bottom 0.813: OK1.1 R7.2
N$5
  Top 1.27: VIN.3 77.55,58.34 R14.2 74.93,58.42 73.66,59.69 L2.1
N$6
  Top 1.27: VIN.2 R14.1 74.93,53.34 73.66,52.07 L2.4
N$7
  Bottom 0.406: OK2.1 R17.2
N$8  (via drill 0.35)
  Top 0.406: LED1.A 53.09,5.11 57.12,5.11 v57.15,5.08
  Bottom 0.406: v57.15,5.08 57.52,4.71 R4.2
N$9
  Top 0.406: LED8.A 25.18,34.44 R37.2
N$10
  Bottom 0.813: OK1.2 R8.2
N$11
  Top 0.406: LED7.A 25.18,29.36 R33.2
N$12
  Top 0.406: LED6.A 25.18,24.28 R29.2
N$13
  Top 0.406: LED5.A 25.18,19.2 R25.2
N$14
  Top 0.406: R26.2 UART1.4
N$15
  Top 0.61: LED15.A R30.1
N$16
  Bottom 0.813: OK3.1 R11.2
N$17
  Top 0.61: R18.1 66.41,2.42 65.02,3.81 OK2.3
N$19
  Bottom 0.813: L2.2 65.7,60.16 D11.A
N$20
  Bottom 0.813: OK3.2 R12.2
N$21  (via drill 3.1)
  other vias: 83.82,2.54
N$22  (via drill 3.1)
  other vias: 5.08,2.54
N$23
  Top 0.406: LED2.A 25.18,4.04 R9.2
N$24
  Top 0.406: LED3.A 25.18,9.04 R13.2
N$25
  Bottom 0.813: OK4.1 R15.2
N$26
  Bottom 0.813: OK4.2 R16.2
N$27
  Top 0.406: LED4.A 25.18,14.12 R19.2
N$28  (via drill 0.35)
  Top 0.406: U3.33 46.78,37.8 37.97,46.61 15.37,46.61 14.61,47.37 v14.61,51.31
  Bottom 0.406: v14.61,51.31 13.84,52.07 R20.2
N$29  (via drill 0.35)
  Top 0.406: v15.88,48.26 16.38,47.75 37.85,47.75 43.99,41.61 U3.36
  Bottom 0.406: v15.88,48.26 14.61,49.53 R21.2
N$31
  Bottom 0.813: OK5.1 R23.2
N$32
  Bottom 0.813: OK5.2 R24.2
N$44
  Bottom 0.813: OK6.1 R27.2
N$45
  Bottom 0.813: OK6.2 R28.2
N$48
  Bottom 0.813: OK7.1 R31.2
N$49
  Bottom 0.813: OK7.2 R32.2
N$52
  Bottom 0.813: OK8.1 R35.2
N$53
  Bottom 0.813: OK8.2 R36.2
N$62
  Bottom 0.813: OK9.1 R39.2
N$63
  Bottom 0.813: OK9.2 R40.2
N$66
  Bottom 0.813: R7.1 6.38,6.35 DI0.2
N$67
  Top 0.61: Q1.B 68.21,4.05 R18.2
N$68
  Top 0.61: R44.1 66.17,7.49 64.77,8.89 OK10.3
N$70
  Bottom 0.406: OK10.1 R43.2
N$71  (via drill 0.35)
  Top 0.406: LED10.A 53.12,10.16 v57.15,10.16
  Bottom 0.406: v57.15,10.16 57.52,9.79 R46.2
N$73
  Top 0.61: Q2.B 68.21,9.26 R44.2
N$74
  Top 0.61: R48.1 66.41,12.71 65.15,13.97 OK11.3
N$76
  Bottom 0.406: OK11.1 R47.2
N$77  (via drill 0.35)
  Top 0.406: LED11.A 52.99,15.24 v57.15,15.24
  Bottom 0.406: v57.15,15.24 57.52,14.87 R50.2
N$79
  Top 0.61: Q3.B 68.21,14.34 R48.2
N$80
  Top 0.61: R52.1 66.29,17.78 65.02,19.05 OK12.3
N$82
  Bottom 0.406: OK12.1 R51.2
N$83  (via drill 0.35)
  Top 0.406: LED12.A 57.12,20.35 v57.15,20.32
  Bottom 0.406: v57.15,20.32 57.52,19.95 R54.2
N$84
  Top 0.406: LED9.A 25.18,39.52 R41.2
N$85
  Top 0.61: Q4.B 68.21,19.42 R52.2
N$86
  Top 0.61: R56.1 66.29,22.86 65.02,24.13 OK13.3
N$87
  Bottom 0.813: R11.1 6.33,11.43 DI0.1
N$88
  Bottom 0.406: OK13.1 R55.2
N$89  (via drill 0.35)
  Top 0.406: LED13.A 53.59,25.43 57.12,25.43 v57.15,25.4
  Bottom 0.406: v57.15,25.4 57.52,25.03 R58.2
N$90
  Bottom 0.813: R15.1 6.38,16.51 DI1.2
N$91
  Top 0.61: Q5.B 68.21,24.5 R56.2
N$92
  Top 0.61: R60.1 66.17,27.81 64.77,29.21 OK14.3
N$93
  Bottom 0.813: R23.1 6.33,21.59 DI1.1
N$94
  Bottom 0.406: OK14.1 R59.2
N$95  (via drill 0.35)
  Top 0.406: LED14.A 53.43,30.77 53.72,30.48 v57.15,30.48
  Bottom 0.406: v57.15,30.48 57.52,30.11 R62.2
N$96
  Bottom 0.813: R27.1 6.38,26.67 DI2.2
N$97
  Top 0.61: Q6.B 68.21,29.58 R60.2
N$98
  Bottom 0.813: R31.1 6.33,31.75 DI2.1
N$99
  Bottom 0.813: R35.1 6.3,36.83 DI3.3
N$100
  Bottom 0.813: R39.1 6.22,41.91 DI3.2
N$101
  Bottom 1.016: D4.C 7.15,48.06 DI3.1
N$102  (via drill 3.1)
  other vias: 5.08,63.5
N$103  (via drill 3.1)
  other vias: 83.82,63.5
RST  (via drill 0.35)
  Top 0.305: U3.12 33.1,30.18 v33.15,30.23
  Bottom 0.406: U$2.RST 27.56,16.64 27.05,17.15 27.05,25.78 31.5,30.23 v33.15,30.23
RX0  (via drill 0.35)
  Top 0.406: U3.34 49.83,39.07 v50.93,37.97
  Bottom 0.305: 52.44,37.97 R2.1
  Bottom 0.406: v50.93,37.97 52.44,37.97
RX2
  Top 0.406: R26.1 68.95,36.31 66.93,34.29 62.87,34.29 61.85,33.27 52.32,33.27 51.56,32.51 51.56,30.61 51.13,30.18 U3.27
SCL
  Top 0.305: U1.6 14.61,56.52 15.61,57.52 R5.1
  Top 0.508: U1.6 6.98,56.52 5.08,54.61 I2C.2
  Bottom 0.508: I2C.2 7.98,53.37 8.76,52.58 8.76,49.91 9.14,49.53 R21.1
SDA
  Top 0.305: U1.5 13.97,57.78 14.48,58.29 14.48,62.87 14.99,63.37 R3.1
  Top 0.508: U1.5 5.69,57.78 I2C.1
  Bottom 0.508: I2C.1 9.42,58.4 10.53,57.29 R20.1
TX0  (via drill 0.35)
  Top 0.406: v50.42,40.39 50.37,40.34 U3.35
  Bottom 0.305: 52.19,42.16 54.22,42.16 R1.1
  Bottom 0.406: 52.19,42.16 51.56,42.16 50.42,41.02 v50.42,40.39
TX2
  Top 0.406: R22.1 68.45,39.37 67.44,38.35 67.44,36.07 66.55,35.18 62.36,35.18 61.47,34.29 51.82,34.29 50.93,33.4 50.93,31.88 50.5,31.45 U3.28
VCC  (via drill 0.35)
  Top 0.406: R9.1 23.48,4.32 22.72,5.08 18.42,5.08 18.03,5.46 18.03,10.16 | 18.03,10.16 18.03,15.24 | 18.03,15.24 18.03,20.32 | 18.03,20.32 18.03,25.4 | 18.03,25.4 18.03,30.48 | 18.03,30.48 18.03,35.56 | 18.03,35.56 18.03,39.62 | 18.03,39.62 19.05,40.64 22.86,40.64 23.23,40.27 R41.1 | 18.03,35.56 22.86,35.56 23.23,35.19 R37.1 | 18.03,30.48 22.86,30.48 23.23,30.11 R33.1 | 18.03,25.4 22.86,25.4 23.23,25.03 R29.1 | 18.03,20.32 22.86,20.32 23.23,19.95 R25.1 | 18.03,15.24 22.86,15.24 23.23,14.87 R19.1 | 18.03,10.16 22.86,10.16 23.23,9.79 R13.1 | 18.03,39.62 18.03,42.55 v18.42,42.93
  Top 0.508: U$2.3V3 U$2.3V3.2 | R9.1 23.48,2.42 24.51,1.4 45.59,1.4
  Top 0.61: U$2.3V3.2 35.43,11.56 45.59,1.4 58.55,1.4 v59.69,2.54
  Top 0.813: U3.2 33.83,42.88 v35.31,41.4
  Bottom 0.305: D2.C 32,11.61 29.39,11.61 U$2.3V3.2
  Bottom 0.406: R4.1 59.69,3.81 60.45,4.57 60.45,6.35 | 60.45,26.67 60.45,29.21 | 60.45,26.67 60.45,24.13 | 60.45,24.13 60.45,21.59 | 60.45,21.59 60.45,19.05 | 60.45,19.05 60.45,16.51 | 60.45,16.51 60.45,13.97 | 60.45,13.97 60.45,11.43 | 60.45,11.43 60.45,8.89 | 60.45,8.89 60.45,6.35 | R17.1 60.45,6.35 | R46.1 60.45,8.89 | R43.1 60.45,11.43 | R50.1 60.45,13.97 | R47.1 60.45,16.51 | R54.1 60.45,19.05 | R51.1 60.45,21.59 | R58.1 60.45,24.13 | R55.1 60.45,26.67 | R62.1 60.45,29.21 | 60.45,29.21 60.45,29.72 59.32,30.85 R59.1 59.32,32.88 58.93,33.27 56.12,33.27 R6.2 | C10.1 33.31,10.3 D2.C | v18.42,42.93 18.67,43.18 21.08,43.18 | IC1.2 39.35,52.47 D58.C 39.09,51.92 39.74,51.27 C8.1
  Bottom 0.508: IC1.2 39.35,57.12 39.88,57.66 45.34,57.66 46.99,56.01 C5.A | R10.2 21.84,43.94 21.08,43.18 33.53,43.18 v35.31,41.4
  Bottom 0.61: v59.69,2.54 59.69,3.81
  Bottom 0.813: v35.31,41.4 35.43,41.53 37.85,41.53 39.09,42.78 39.09,51.92
Y0
  Top 1.016: DO0.1 83.49,7.62 71.12,7.62 69.85,6.35 Q1.C
  Bottom 1.016: DO0.1 83.49,7.62 82.34,7.62 D3.C
Y1
  Top 1.016: DO0.2 83.57,12.7 71.12,12.7 69.85,11.43 Q2.C
  Bottom 1.016: DO0.2 83.57,12.7 82.55,12.7 80.01,10.16 D5.C
Y2
  Top 1.016: DO0.3 83.64,17.78 71.12,17.78 69.85,16.51 Q3.C
  Bottom 1.016: DO0.3 83.64,17.78 82.21,17.78 D7.C
Y3
  Top 1.016: DO1.1 71.27,23.01 69.85,21.59 Q4.C
  Bottom 1.016: DO1.1 83.67,22.86 82.21,22.86 D8.C
Y4
  Top 1.016: DO1.2 83.72,27.94 71.12,27.94 69.85,26.67 Q5.C
  Bottom 1.016: DO1.2 83.72,27.94 82.21,27.94 D9.C
Y5
  Top 1.016: DO3.1 83.74,33.02 71.12,33.02 69.85,31.75 Q6.C
  Bottom 1.016: D10.C 82.29,33.1 DO3.1

### Text on the board
tPlace: VIN | SDA | SCL | 5V | COM | + | I36 | COM | - | UART2 | UART0 | I39 | O0 | I34 | O4 | I35 | O2 | I32 | O15 | I33 | O13 | I25 | O14 | I26 | ESP32 INDUSTRIAL